# EAGLE design main (EAGLE 6.4)
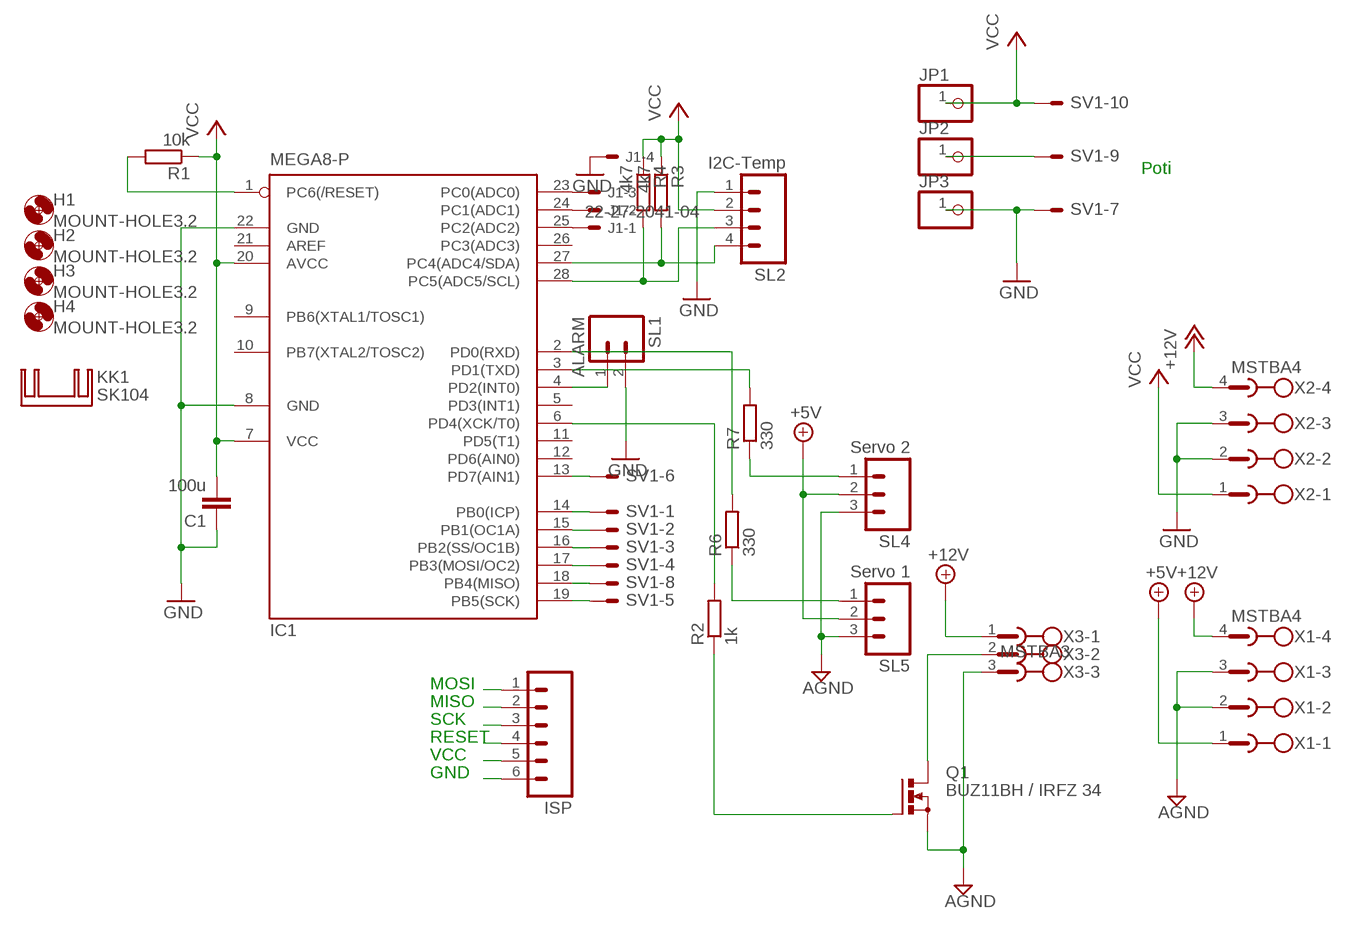
[diagram p0: schematic, sheet 1]

## Parts
C1  100u  C-EU025-030X050  [C025-030X050]
H1  MOUNT-HOLE3.2  [3,2]
H2  MOUNT-HOLE3.2  [3,2]
H3  MOUNT-HOLE3.2  [3,2]
H4  MOUNT-HOLE3.2  [3,2]
IC1  MEGA8-P  [DIL28-3]
ISP  M06  [06P]
J1  22-27-2041-04  [6410-04]
JP1  PINHD-1X1  [1X01]
JP2  PINHD-1X1  [1X01]
JP3  PINHD-1X1  [1X01]
KK1  SK104  [SK104]
Q1  BUZ11BH / IRFZ 34  BUZ11BH  [TO220BH]
R1  10k  R-EU_0207/10  [0207/10]
R2  1k  R-EU_0207/10  [0207/10]
R3  4k7  R-EU_0207/10  [0207/10]
R4  4k7  R-EU_0207/10  [0207/10]
R6  330  R-EU_0207/10  [0207/10]
R7  330  R-EU_0207/12  [0207/12]
SL1  ALARM  M02  [02P]
SL2  I2C-Temp  M04  [04P]
SL4  Servo 2  M03  [03P]
SL5  Servo 1  M03  [03P]
SV1  ML10E  [ML10]
X1  MSTBA4  [MSTBA4]
X2  MSTBA4  [MSTBA4]
X3  MSTBA3  [MSTBA3]

## Nets
+5V: SL4.2 SL5.2 X1.1
+12V1: X2.4 ; supply symbol labelled +12V
+12V2: X1.4 X3.1 ; supply symbol labelled +12V
AGND: Q1.S SL4.3 SL5.3 X1.2 X1.3 X3.3
GND: C1.1 IC1.8(GND) IC1.22(GND) ISP.6 J1.4 JP3.1 SL1.2 SL2.1 SV1.7 X2.2 X2.3
MISO: IC1.18(PB4(MISO)) ISP.2 SV1.8
MOSI: IC1.17(PB3(MOSI/OC2)) ISP.1 SV1.4
N$1: IC1.23(PC0(ADC0)) J1.3
N$2: IC1.15(PB1(OC1A)) SV1.2
N$3: IC1.16(PB2(SS/OC1B)) SV1.3
N$4: IC1.28(PC5(ADC5/SCL)) R4.2 SL2.3
N$5: IC1.27(PC4(ADC4/SDA)) R3.2 SL2.4
N$6: Q1.D X3.2
N$7: Q1.G R2.1
N$8: IC1.14(PB0(ICP)) SV1.1
N$9: JP2.1 SV1.9
N$10: IC1.2(PD0(RXD)) R6.2
N$11: IC1.6(PD4(XCK/T0)) R2.2
N$12: R6.1 SL5.1
N$13: R7.1 SL4.1
N$14: IC1.24(PC1(ADC1)) J1.2
N$15: IC1.25(PC2(ADC2)) J1.1
N$16: IC1.4(PD2(INT0)) SL1.1
N$17: IC1.13(PD7(AIN1)) SV1.6
N$20: IC1.3(PD1(TXD)) R7.2
RESET: IC1.1(PC6(/RESET)) ISP.4 R1.2
SCK: IC1.19(PB5(SCK)) ISP.3 SV1.5
VCC: C1.2 IC1.7(VCC) IC1.20(AVCC) ISP.5 JP1.1 R1.1 R3.1 R4.1 SL2.2 SV1.10 X2.1
Unconnected: IC1.5(PD3(INT1)) IC1.9(PB6(XTAL1/TOSC1)) IC1.10(PB7(XTAL2/TOSC2)) IC1.11(PD5(T1)) IC1.12(PD6(AIN0)) IC1.21(AREF) IC1.26(PC3(ADC3))

## Notes on the sheet
- Poti
- MOSI
- MISO
- SCK
- RESET
- VCC
- GND

## Library data of the parts
C1 = rcl:C-EU: CAPACITOR, European symbol
H1-H4 = holes:MOUNT-HOLE: MOUNTING HOLE with drill center marker
IC1 = atmel:MEGA8-P: MICROCONTROLLER 8 Kbytes FLASH, 1 kbytes SRAM, 512 bytes EEPROM, USART, 4-channel 10 bit ADC, 2-channel 8 bit ADC Pin compatible with Atmega48, ATMega88, ATMega168 Source: avr.lbr; OC_FARNELL: unknown; OC_NEWARK: unknown
ISP = con-amp-quick:M06: AMP QUICK CONNECTOR
J1 = con-molex:22-?-04: CONNECTOR wire to board 2.54 mm (.1 inch) pitch header; OC_FARNELL: unknown; OC_NEWARK: unknown
JP1-JP3 = pinhead:PINHD-1X1: PIN HEADER
KK1 = heatsink:SK104: HEATSINK manufacturer Fischer/distributor Buerklin
Q1 = transistor-power:BUZ11: N-CHANNEL MOS FET
R1-R4 R6 R7 = rcl:R-EU_: RESISTOR, European symbol
SL1 = con-amp-quick:M02: AMP QUICK CONNECTOR; OC_FARNELL: unknown; OC_NEWARK: unknown
SL2 = con-amp-quick:M04: AMP QUICK CONNECTOR; OC_FARNELL: unknown; OC_NEWARK: unknown
SL4 SL5 = con-amp-quick:M03: AMP QUICK CONNECTOR; OC_FARNELL: unknown; OC_NEWARK: unknown
SV1 = con-ml:ML10E: HARTING; OC_FARNELL: unknown; OC_NEWARK: unknown
X1 X2 = con-phoenix-508:MSTBA4: PHOENIX; MF: FARNELL; MPN: 1757268; OC_FARNELL: 3705195; OC_NEWARK: 71C4163
X3 = con-phoenix-508:MSTBA3: PHOENIX; MF: FARNELL; MPN: 1757255; OC_FARNELL: 3705183; OC_NEWARK: 71C4162

## Board
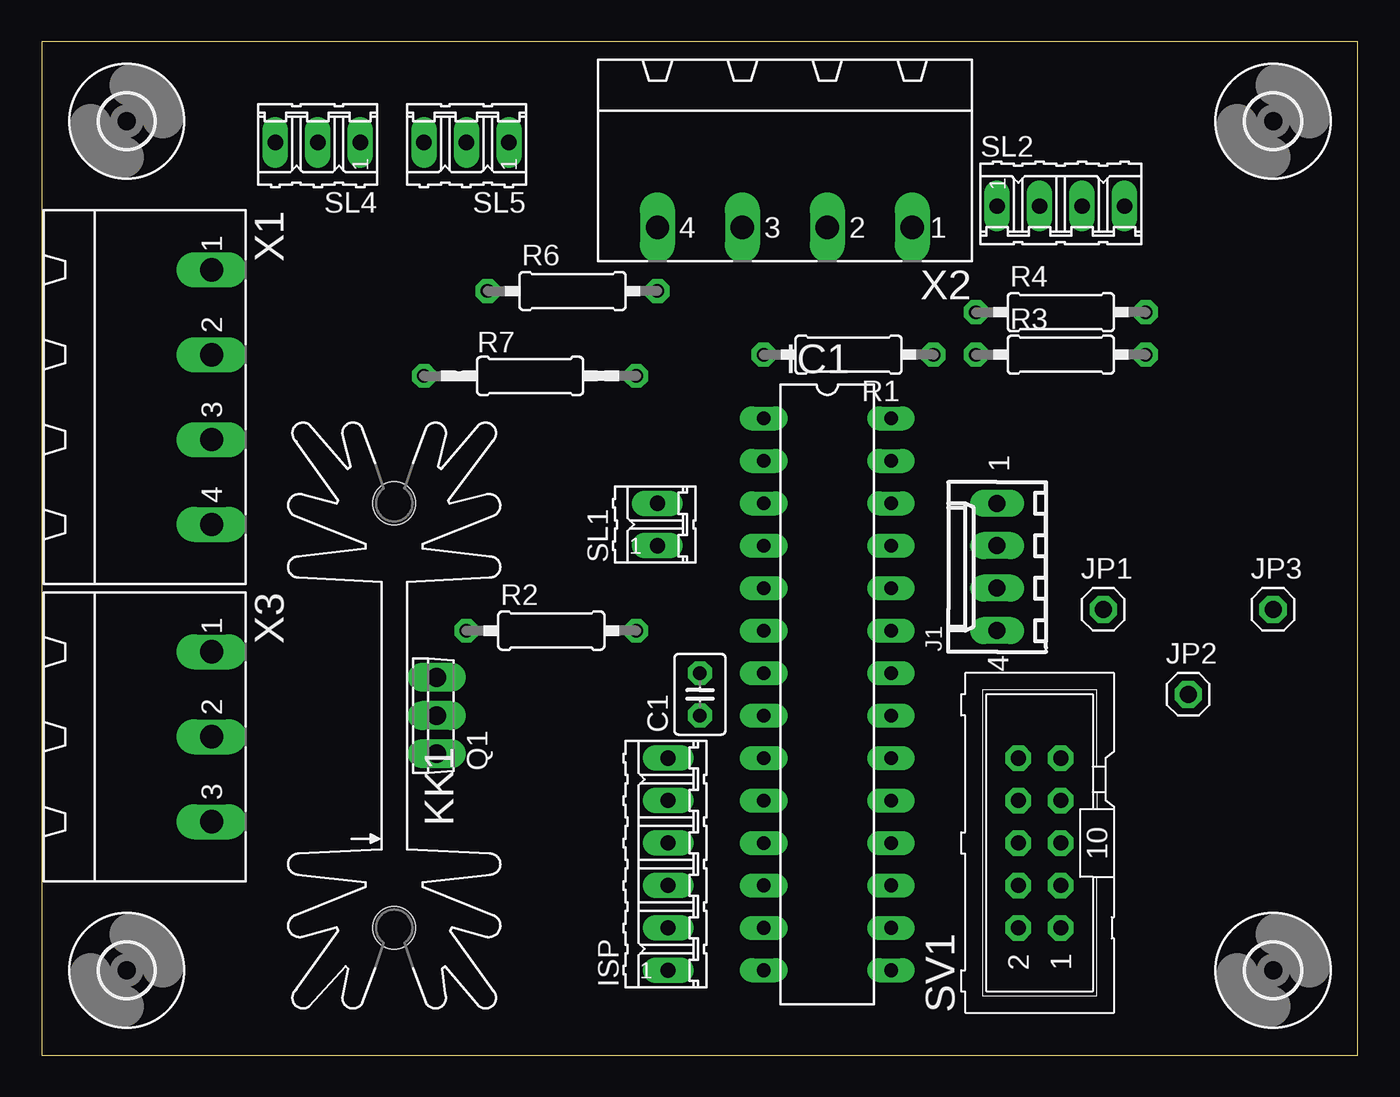
[diagram p1: board, top side]
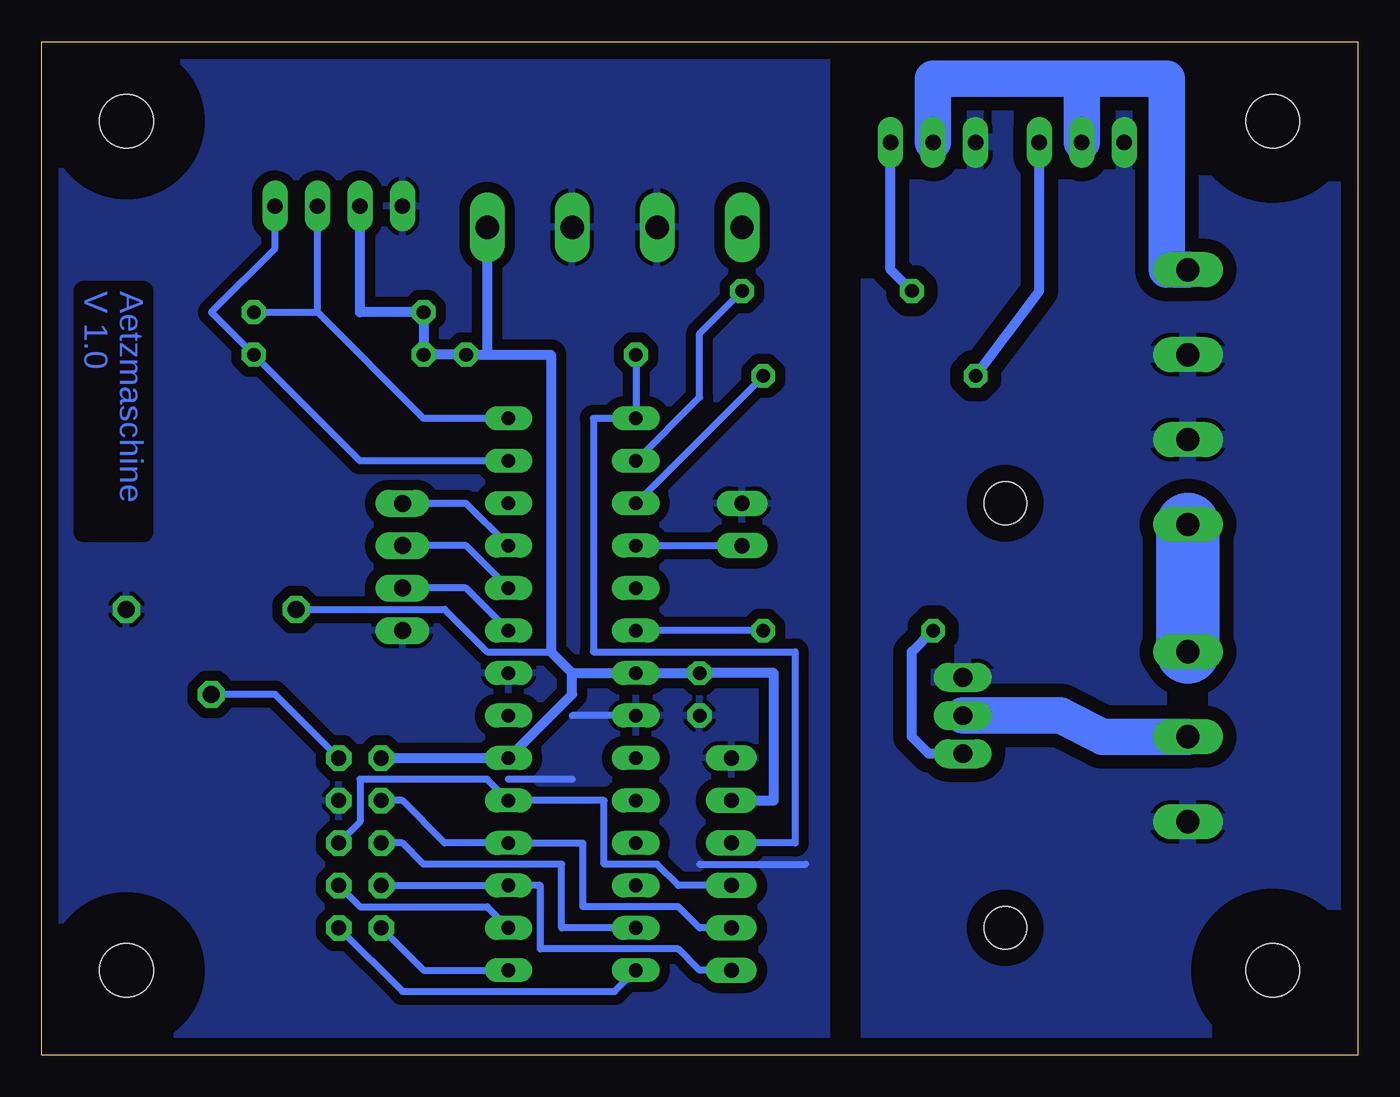
[diagram p2: board, bottom side, seen from below]

Size 78.72 x 60.63 mm. Coordinates in mm from the lower left corner, seen from the top.
Outline: 0,0 78.72,0 78.72,60.63 0,60.63 0,0
Copper layers (1*16): Top 0.035mm / dielectric 1.5mm / Bottom 0.035mm
Design rules "default *": minimum track width 10mil, minimum drill 24mil, track to track 8mil, track to pad 8mil, pad to pad 8mil, via to via 8mil, smd to smd 8mil, copper to edge 40mil, drill to drill 8mil, minimum pad ring 12mil, minimum via ring 12mil, stop-mask expansion 4mil, vias tented up to drill 0mil, thermal gap 10mil

### Footprints (pad centres in the part's own frame; a part is rotated, then mirrored left to right if it is on the bottom)
C025-030X050 = drill 0.813 octagon: 1 -1.27,0; 2 1.27,0
3,2 = hole 3.2: 0,0
DIL28-3 = drill 0.813 long: 1 -16.51,-3.81; 2 -13.97,-3.81; 3 -11.43,-3.81; 4 -8.89,-3.81; 5 -6.35,-3.81; 6 -3.81,-3.81; 7 -1.27,-3.81; 8 1.27,-3.81; 9 3.81,-3.81; 10 6.35,-3.81; 11 8.89,-3.81; 12 11.43,-3.81; 13 13.97,-3.81; 14 16.51,-3.81; 15 16.51,3.81; 16 13.97,3.81; 17 11.43,3.81; 18 8.89,3.81; 19 6.35,3.81; 20 3.81,3.81; 21 1.27,3.81; 22 -1.27,3.81; 23 -3.81,3.81; 24 -6.35,3.81; 25 -8.89,3.81; 26 -11.43,3.81; 27 -13.97,3.81; 28 -16.51,3.81
06P = drill 0.914 long: 1 -6.35,0; 2 -3.81,0; 3 -1.27,0; 4 1.27,0; 5 3.81,0; 6 6.35,0
6410-04 = drill 1.016 long: 1 3.81,0; 2 1.27,0; 3 -1.27,0; 4 -3.81,0
1X01 = drill 1.016 octagon: 1 0,0
SK104 = hole 2.54: -12.7,-0.762; 12.7,-0.762
C369-1 = drill 1.118 long: D 0,-1.397; G -2.286,-1.397; S 2.286,-1.397
0207/10 = drill 0.813 octagon: 1 -5.08,0; 2 5.08,0
0207/12 = drill 0.813 octagon: 1 -6.35,0; 2 6.35,0
02P = drill 0.914 long: 1 -1.27,0; 2 1.27,0
04P = drill 0.914 long: 1 -3.81,0; 2 -1.27,0; 3 1.27,0; 4 3.81,0
03P = drill 0.914 long: 1 -2.54,0; 2 0,0; 3 2.54,0
ML10 = drill 0.914 octagon: 1 -5.08,-1.27; 2 -5.08,1.27; 3 -2.54,-1.27; 4 -2.54,1.27; 5 0,-1.27; 6 0,1.27; 7 2.54,-1.27; 8 2.54,1.27; 9 5.08,-1.27; 10 5.08,1.27
MSTBA4 = drill 1.397 long: 1 -7.62,5.08; 2 -2.54,5.08; 3 2.54,5.08; 4 7.62,5.08
MSTBA3 = drill 1.397 long: 1 -5.08,5.08; 2 0,5.08; 3 5.08,5.08

### Placement (x,y rotation side)
C1  39.37,21.59 90 top
H1  5.08,55.88 0 top
H2  73.66,5.08 0 top
H3  5.08,5.08 0 top
H4  73.66,55.88 0 top
IC1  46.99,21.59 270 top
ISP  37.47,11.43 90 top
J1  57.15,29.21 90 top
JP1  63.5,26.67 0 top
JP2  68.58,21.59 0 top
JP3  73.66,26.67 0 top
KK1  20.32,20.32 90 top
Q1  BUZ11BH / IRFZ 34  [C369-1]  22.23,20.32 90 top
R1  48.26,41.91 180 top
R2  30.48,25.4 0 top
R3  60.96,41.91 0 top
R4  60.96,44.45 0 top
R6  31.75,45.72 0 top
R7  29.21,40.64 0 top
SL1  36.83,31.75 90 top
SL2  60.96,50.8 0 top
SL4  16.51,54.61 180 top
SL5  25.4,54.61 180 top
SV1  59.69,12.7 90 top
X1  5.08,39.37 270 top
X2  44.45,54.61 180 top
X3  5.08,19.05 270 top

### Tracks (layer width: path | path; a pad name or v marks a point on that pad's centre or on a via)
+5V
  Bottom 2.184: SL4.2 16.51,58.42 | 16.51,58.42 25.4,58.42 SL5.2 | 16.51,58.42 11.43,58.42 11.43,46.99 X1.1
+12V2
  Bottom 3.81: X1.4 X3.1
AGND
  pour Bottom (isolate 0.813): -1.27,-0.64 29.21,-0.64 29.21,62.23 -1.27,62.23
GND
  Bottom 0.406: IC1.8 46.99,20.32 | 46.99,16.51 50.8,16.51 | 39.37,11.43 33.02,11.43
  pour Bottom (isolate 0.61, rank 2): 31.75,62.23 80.01,62.23 81.28,-1.27 31.75,-1.27
MISO
  Bottom 0.406: SV1.8 57.15,15.24 54.61,12.7 IC1.18 46.35,12.7 46.35,8.89 40.64,8.89 39.37,7.62 ISP.2
MOSI
  Bottom 0.406: SV1.4 IC1.17 48.9,10.16 48.9,6.35 40.64,6.35 39.37,5.08 ISP.1
N$1
  Bottom 0.406: IC1.23 53.34,27.94 J1.3
N$2
  Bottom 0.406: SV1.2 55.88,5.08 IC1.15
N$3
  Bottom 0.406: SV1.3 59.69,8.89 52.07,8.89 IC1.16
N$4
  Bottom 0.406: R4.2 62.23,44.45 | 62.23,44.45 SL2.3 | IC1.28 55.88,38.1 62.23,44.45
N$5
  Bottom 0.406: SL2.4 64.77,48.26 68.58,44.45 R3.2 59.69,35.56 IC1.27
N$6
  Bottom 2.184: X3.2 15.24,19.05 17.78,20.32 Q1.D
N$7
  Bottom 0.61: Q1.G 25.65,18.03 26.67,19.05 26.67,24.13 R2.1
N$8
  Bottom 0.406: SV1.1 57.15,3.81 44.45,3.81 IC1.14
N$9
  Bottom 0.406: SV1.9 64.77,21.59 JP2.1
N$10
  Bottom 0.406: IC1.2 39.37,39.37 39.37,43.18 R6.2
N$11
  Bottom 0.406: R2.2 IC1.6
N$12
  Bottom 0.61: R6.1 27.94,46.99 SL5.1
N$13
  Bottom 0.61: R7.1 19.05,45.72 SL4.1
N$14
  Bottom 0.406: IC1.24 53.34,30.48 J1.2
N$15
  Bottom 0.406: IC1.25 53.34,33.02 J1.1
N$16
  Bottom 0.406: IC1.4 SL1.1
N$17
  Bottom 0.406: IC1.13 47.62,7.62 47.62,11.43 55.88,11.43 57.15,12.7 SV1.6
N$20
  Bottom 0.406: IC1.3 R7.2
RESET
  Bottom 0.406: R1.2 IC1.1 45.72,38.1 45.72,24.13 33.66,24.13 33.66,12.7 ISP.4
SCK
  Bottom 0.406: ISP.3 40.64,10.16 41.91,11.43 45.09,11.43 45.09,15.24 IC1.19 52.07,16.51 59.69,16.51 59.69,13.97 SV1.5
VCC
  Bottom 0.406: 48.26,24.13 52.07,24.13 54.61,26.67 JP1.1
  Bottom 0.61: SL2.2 59.69,44.45 R4.1 R3.1 R1.1 52.07,41.91 | ISP.5 34.92,15.24 34.92,22.86 C1.2 IC1.7 46.99,22.86 | 46.99,22.86 48.26,24.13 48.26,41.91 52.07,41.91 | 46.99,22.86 46.99,21.59 IC1.20 SV1.10 | X2.1 52.07,41.91

### Text on the board
Bottom: Aetzmaschine / V 1.0